# EAGLE design Electro Transmitter Rev 1 (EAGLE 9.5.0)
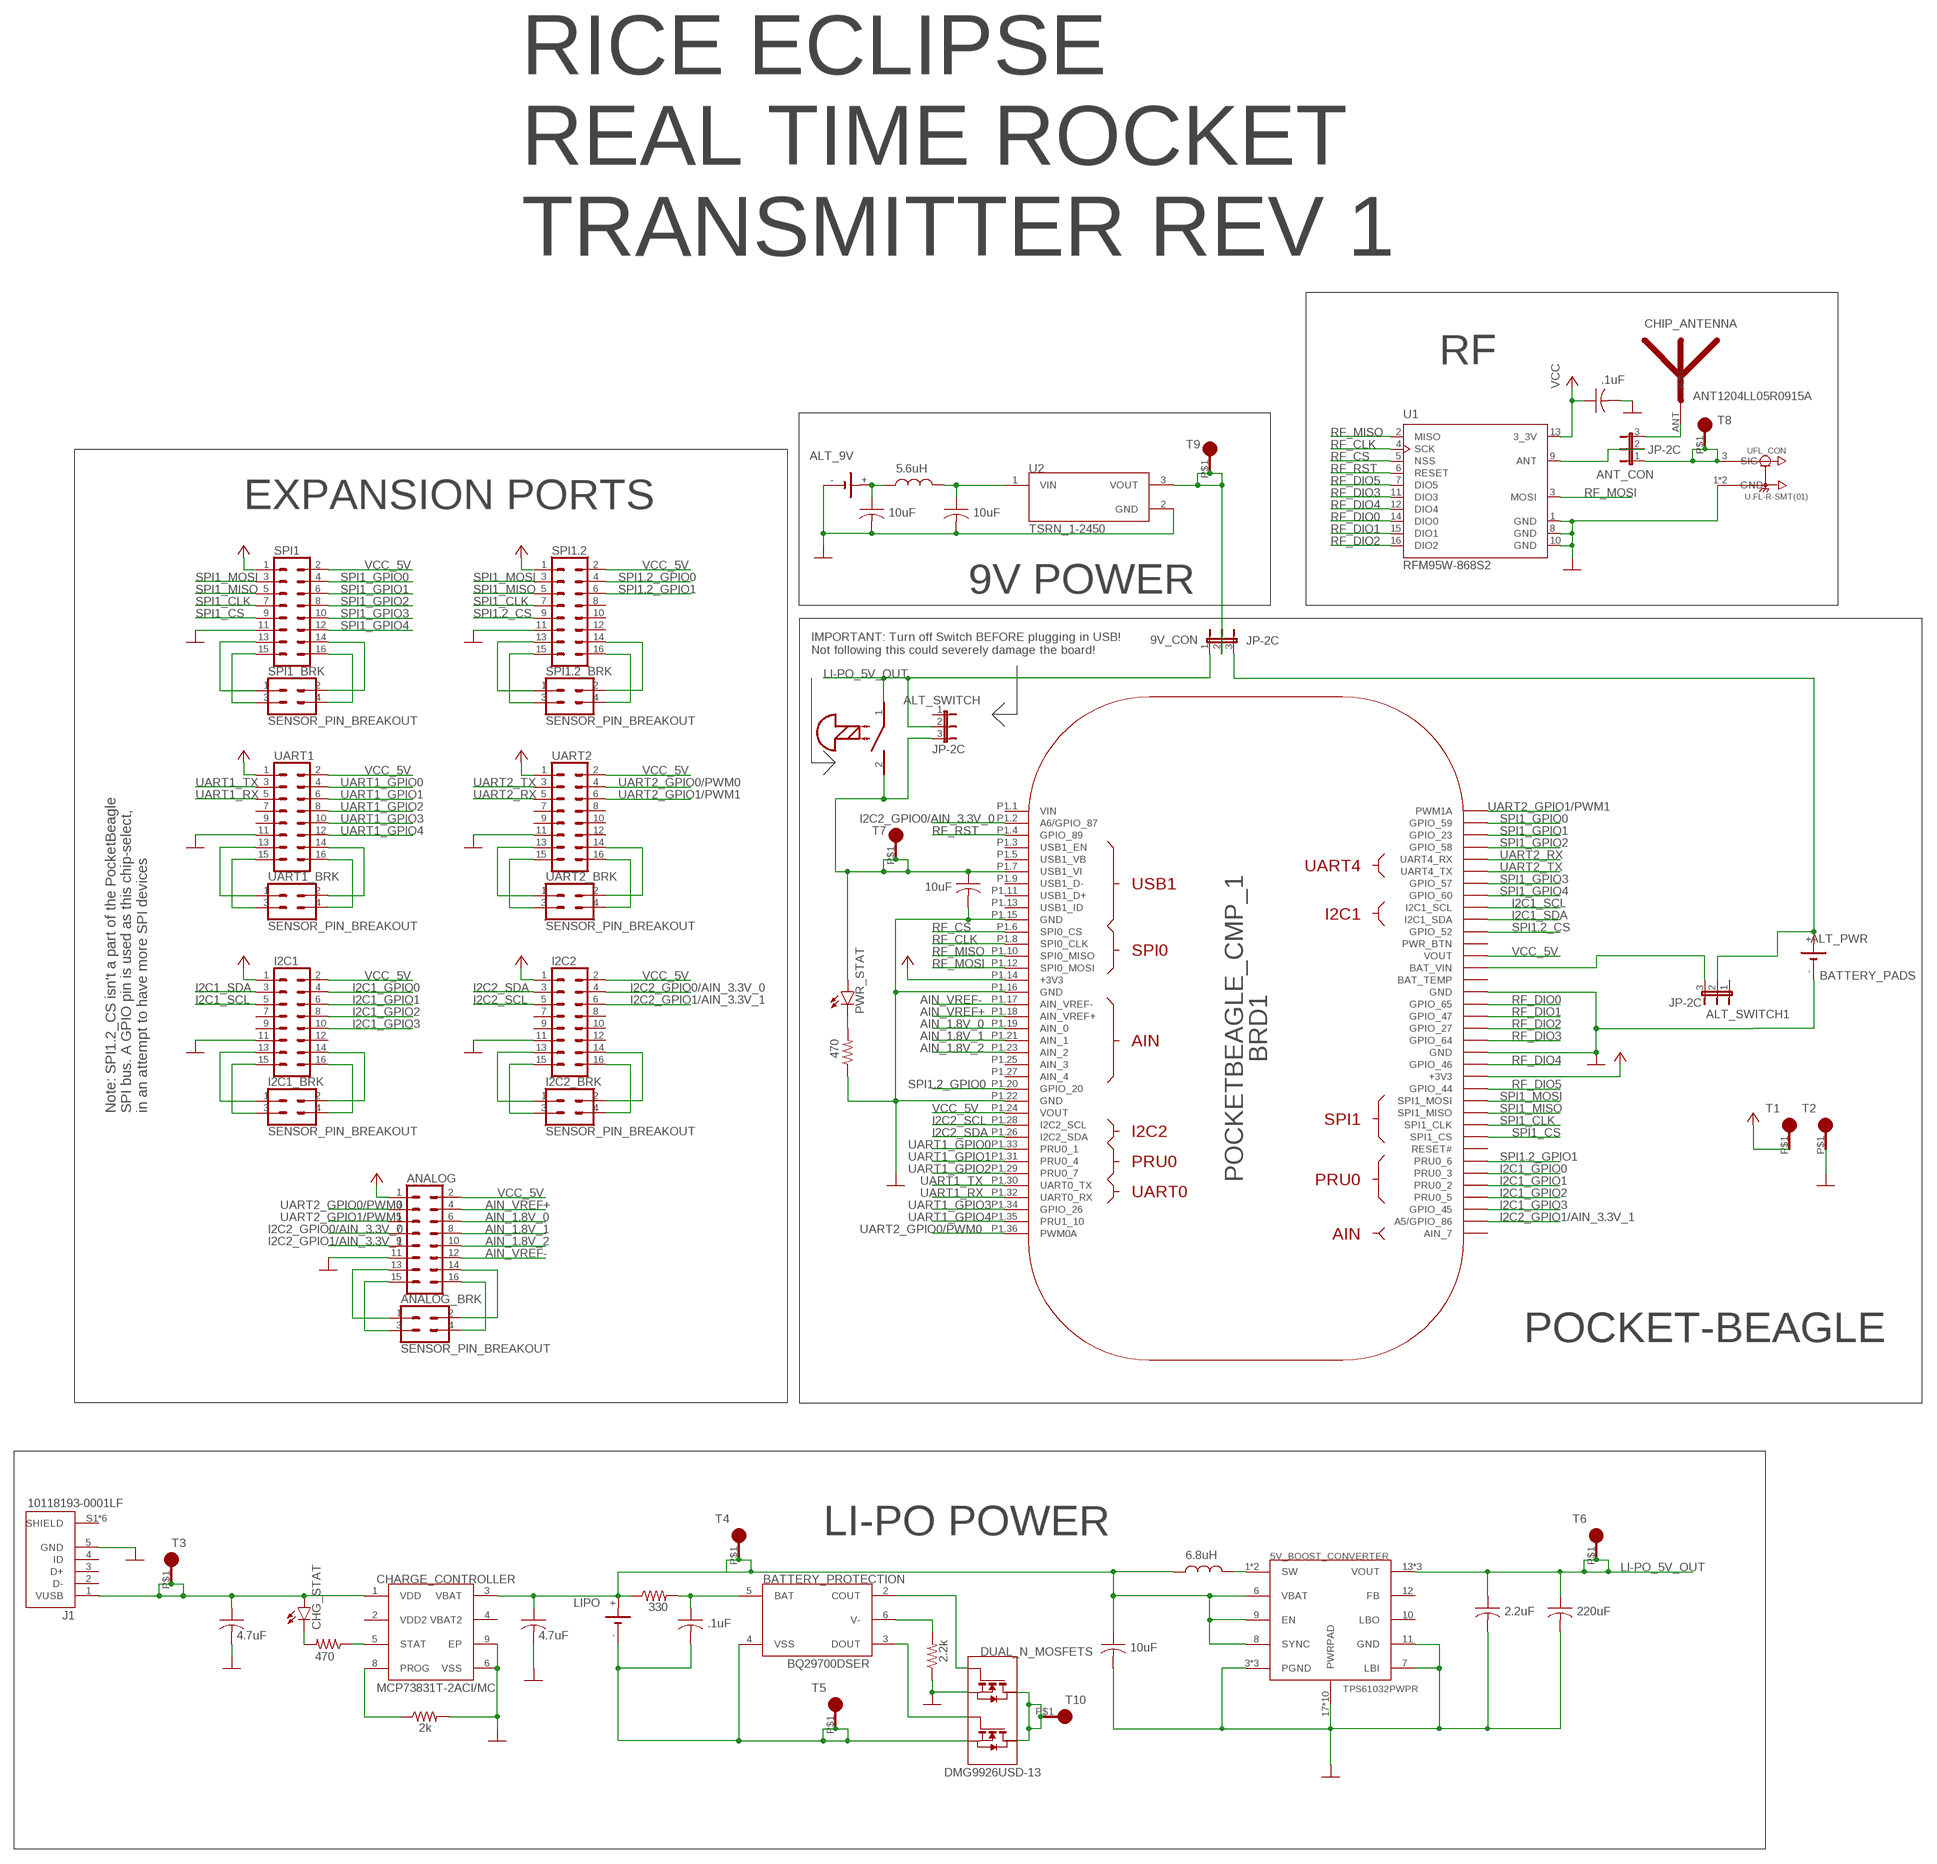
[diagram p0: schematic, sheet 1]

## Parts
5V_BOOST_CONVERTER  TPS61032PWPR  [SOP65P640X110-17N]
9V_C1  10uF  C-SMD  [C1206]
9V_C2  10uF  C-SMD  [C1206]
9V_CON  JP-2C  [JP2]
9V_L1  5.6uH  L_SMD  [L-DS75LC]
ALT_9V  BATTERY_PADS  [POWER_PADS]
ALT_PWR  BATTERY_PADS  [POWER_PADS]
ALT_SWITCH  JP-2C  [JP2]
ALT_SWITCH1  JP-2C  [JP2]
ANALOG  2X6 FEMALE  SENSOR_BREAKOUTPTH_FEMALE  [2X7]
ANALOG_BRK  SENSOR_PIN_BREAKOUT  [2X2]
ANT_CON  JP-2C  [JP2]
BAT_C1  .1uF  C-SMD  [C1206]
BAT_PWR  SCREW_SWITCH  [SCREW_SWITCH]
BAT_R1  330  R-SMD1206  [R1206]
BAT_R2  2.2k  R-SMD1206  [R1206]
BATTERY_PROTECTION  BQ29700DSER  [SON50P150X150X80-6N]
BRD1  POCKETBEAGLE_CMP_1  [POCKETBEAGLE_CMP]
CHARGE_CONTROLLER  MCP73831T-2ACI/MC  [SON50P200X300X100-9N]
CHG_C1  4.7uF  C-SMD  [C1206]
CHG_C2  4.7uF  C-SMD  [C1206]
CHG_R1  470  R-SMD1206  [R1206]
CHG_R2  2k  R-SMD1206  [R1206]
CHG_STAT  LED5MM  [LED5MM]
CHIP_ANTENNA  ANT1204LL05R0915A  [SMD_ANTENNA]
CONV_C1  10uF  C-SMD  [C1206]
CONV_C2  2.2uF  C-SMD  [C1206]
CONV_C3  220uF  C-SMD  [C1206]
CONV_L1  6.8uH  L_SMD  [L-DS75LC]
DUAL_N_MOSFETS  DMG9926USD-13  [SOIC127P600X175-8N]
I2C1  2X6 FEMALE  SENSOR_BREAKOUTPTH_FEMALE  [2X7]
I2C1_BRK  SENSOR_PIN_BREAKOUT  [2X2]
I2C2  2X6 FEMALE  SENSOR_BREAKOUTPTH_FEMALE  [2X7]
I2C2_BRK  SENSOR_PIN_BREAKOUT  [2X2]
J1  10118193-0001LF  [FCI_10118193-0001LF]
LED_R_1  470  R-SMD1206  [R1206]
LIPO  BATTERY_PADS  [POWER_PADS]
PWR_C1  10uF  C-SMD  [C1206]
PWR_STAT  LED5MM  [LED5MM]
RF_C1  .1uF  C-SMD  [C1206]
SPI1  2X6 FEMALE  SENSOR_BREAKOUTPTH_FEMALE  [2X7]
SPI1.2  2X6 FEMALE  SENSOR_BREAKOUTPTH_FEMALE  [2X7]
SPI1.2_BRK  SENSOR_PIN_BREAKOUT  [2X2]
SPI1_BRK  SENSOR_PIN_BREAKOUT  [2X2]
T1  TEST_PAD  [TEST_PAD]
T2  TEST_PAD  [TEST_PAD]
T3  TEST_PAD  [TEST_PAD]
T4  TEST_PAD  [TEST_PAD]
T5  TEST_PAD  [TEST_PAD]
T6  TEST_PAD  [TEST_PAD]
T7  TEST_PAD  [TEST_PAD]
T8  TEST_PAD  [TEST_PAD]
T9  TEST_PAD  [TEST_PAD]
T10  TEST_PAD  [TEST_PAD]
U1  RFM95W-868S2  [XCVR_RFM95W-868S2]
U2  TSRN_1-2450  [CONV_TSRN_1-2433]
UART1  2X6 FEMALE  SENSOR_BREAKOUTPTH_FEMALE  [2X7]
UART1_BRK  SENSOR_PIN_BREAKOUT  [2X2]
UART2  2X6 FEMALE  SENSOR_BREAKOUTPTH_FEMALE  [2X7]
UART2_BRK  SENSOR_PIN_BREAKOUT  [2X2]
UFL_CON  U.FL-R-SMT(01)  [HRS_U.FL-R-SMT(01)]

## Nets
9V_+: 9V_C1.1 9V_L1.P$1 ALT_9V.+
9V_VIN: 9V_C2.1 9V_L1.P$2 U2.1(VIN)
9V_VOUT: 9V_CON.2 T9.P$1 U2.3(VOUT)
AIN_1.8V_0: ANALOG.6 BRD1.P1.19(AIN_0)
AIN_1.8V_1: ANALOG.8 BRD1.P1.21(AIN_1)
AIN_1.8V_2: ANALOG.10 BRD1.P1.23(AIN_2)
AIN_VREF+: ANALOG.4 BRD1.P1.18(AIN_VREF+)
AIN_VREF-: ANALOG.12 BRD1.P1.17(AIN_VREF-)
ALT_PWR_+: 9V_CON.3 ALT_PWR.+ ALT_SWITCH1.2
ANT: ANT_CON.3 CHIP_ANTENNA.ANT
BAT: BAT_C1.1 BAT_R1.2 BATTERY_PROTECTION.5(BAT)
BAT_VIN: ALT_SWITCH1.3 BRD1.P2.14(BAT_VIN)
COUT: BATTERY_PROTECTION.2(COUT) DUAL_N_MOSFETS.2(G1)
DOUT: BATTERY_PROTECTION.3(DOUT) DUAL_N_MOSFETS.4(G2)
DRAIN: DUAL_N_MOSFETS.5(D2) DUAL_N_MOSFETS.6(D2) DUAL_N_MOSFETS.7(D1) DUAL_N_MOSFETS.8(D1) T10.P$1
GND: 5V_BOOST_CONVERTER.3(PGND) 5V_BOOST_CONVERTER.4(PGND) 5V_BOOST_CONVERTER.5(PGND) 5V_BOOST_CONVERTER.7(LBI) 5V_BOOST_CONVERTER.11(GND) 5V_BOOST_CONVERTER.17(PWRPAD) 5V_BOOST_CONVERTER.P$1(PWRPAD) 5V_BOOST_CONVERTER.P$2(PWRPAD) 5V_BOOST_CONVERTER.P$3(PWRPAD) 5V_BOOST_CONVERTER.P$4(PWRPAD) 5V_BOOST_CONVERTER.P$5(PWRPAD) 5V_BOOST_CONVERTER.P$6(PWRPAD) 5V_BOOST_CONVERTER.P$7(PWRPAD) 5V_BOOST_CONVERTER.P$8(PWRPAD) 5V_BOOST_CONVERTER.P$9(PWRPAD) 9V_C1.2 9V_C2.2 ALT_9V.- ALT_PWR.- ANALOG.11 BAT_R2.1 BRD1.P1.15(GND) BRD1.P1.16(GND) BRD1.P1.22(GND) BRD1.P2.15(GND) BRD1.P2.21(GND) CHARGE_CONTROLLER.6(VSS) CHARGE_CONTROLLER.9(EP) CHG_C1.2 CHG_C2.2 CHG_R2.2 CONV_C1.2 CONV_C2.2 CONV_C3.2 DUAL_N_MOSFETS.1(S1) I2C1.11 I2C2.11 J1.5(GND) LED_R_1.1 PWR_C1.2 RF_C1.2 SPI1.2.11 SPI1.11 T2.P$1 U1.1(GND) U1.8(GND) U1.10(GND) U2.2(GND) UART1.11 UART2.11 UFL_CON.1(GND) UFL_CON.2(GND)
I2C1_GPIO0: BRD1.P2.30(PRU0_3) I2C1.4
I2C1_GPIO1: BRD1.P2.32(PRU0_2) I2C1.6
I2C1_GPIO2: BRD1.P2.34(PRU0_5) I2C1.8
I2C1_GPIO3: BRD1.P2.33(GPIO_45) I2C1.10
I2C1_SCL: BRD1.P2.9(I2C1_SCL) I2C1.5
I2C1_SDA: BRD1.P2.11(I2C1_SDA) I2C1.3
I2C2_GPIO0/AIN_3.3V_0: ANALOG.7 BRD1.P1.2(A6/GPIO_87) I2C2.4
I2C2_GPIO1/AIN_3.3V_1: ANALOG.9 BRD1.P2.35(A5/GPIO_86) I2C2.6
I2C2_SCL: BRD1.P1.28(I2C2_SCL) I2C2.5
I2C2_SDA: BRD1.P1.26(I2C2_SDA) I2C2.3
LED: LED_R_1.2 PWR_STAT.K(C)
LED-: CHG_R1.2 CHG_STAT.K(C)
LI-PO_5V_OUT: 5V_BOOST_CONVERTER.13(VOUT) 5V_BOOST_CONVERTER.14(VOUT) 5V_BOOST_CONVERTER.15(VOUT) 9V_CON.1 ALT_SWITCH.2 BAT_PWR.1 CONV_C2.1 CONV_C3.1 T6.P$1
LI-PO_+: 5V_BOOST_CONVERTER.6(VBAT) 5V_BOOST_CONVERTER.8(SYNC) 5V_BOOST_CONVERTER.9(EN) BAT_R1.1 CHARGE_CONTROLLER.3(VBAT) CHG_C2.1 CONV_C1.1 CONV_L1.P$1 LIPO.+ T4.P$1
LI-PO_-: BAT_C1.2 BATTERY_PROTECTION.4(VSS) DUAL_N_MOSFETS.3(S2) LIPO.- T5.P$1
N$1: ANT_CON.1 T8.P$1 UFL_CON.3(SIG)
N$20: 5V_BOOST_CONVERTER.1(SW) 5V_BOOST_CONVERTER.2(SW) CONV_L1.P$2
N$21: SPI1.14 SPI1_BRK.2
N$23: SPI1.13 SPI1_BRK.1
N$24: SPI1.15 SPI1_BRK.3
N$25: SPI1.16 SPI1_BRK.4
N$26: SPI1.2.13 SPI1.2_BRK.1
N$27: SPI1.2.14 SPI1.2_BRK.2
N$28: SPI1.2.16 SPI1.2_BRK.4
N$29: SPI1.2.15 SPI1.2_BRK.3
N$30: UART1.13 UART1_BRK.1
N$31: UART1.15 UART1_BRK.3
N$32: UART1.14 UART1_BRK.2
N$33: UART1.16 UART1_BRK.4
N$35: UART2.15 UART2_BRK.3
N$36: UART2.16 UART2_BRK.4
N$37: UART2.14 UART2_BRK.2
N$38: UART2.13 UART2_BRK.1
N$39: I2C1.16 I2C1_BRK.4
N$40: I2C1.15 I2C1_BRK.3
N$41: I2C1.13 I2C1_BRK.1
N$42: I2C1.14 I2C1_BRK.2
N$43: I2C2.15 I2C2_BRK.3
N$44: I2C2.16 I2C2_BRK.4
N$45: I2C2.14 I2C2_BRK.2
N$46: I2C2.13 I2C2_BRK.1
N$47: ANALOG.15 ANALOG_BRK.3
N$48: ANALOG.16 ANALOG_BRK.4
N$49: ANALOG.14 ANALOG_BRK.2
N$50: ANALOG.13 ANALOG_BRK.1
PROG: CHARGE_CONTROLLER.8(PROG) CHG_R2.1
RF_ANT: ANT_CON.2 U1.9(ANT)
RF_CLK: BRD1.P1.8(SPI0_CLK) U1.4(SCK)
RF_CS: BRD1.P1.6(SPI0_CS) U1.5(NSS)
RF_DIO0: BRD1.P2.17(GPIO_65) U1.14(DIO0)
RF_DIO1: BRD1.P2.18(GPIO_47) U1.15(DIO1)
RF_DIO2: BRD1.P2.19(GPIO_27) U1.16(DIO2)
RF_DIO3: BRD1.P2.20(GPIO_64) U1.11(DIO3)
RF_DIO4: BRD1.P2.22(GPIO_46) U1.12(DIO4)
RF_DIO5: BRD1.P2.24(GPIO_44) U1.7(DIO5)
RF_MISO: BRD1.P1.10(SPI0_MISO) U1.2(MISO)
RF_MOSI: BRD1.P1.12(SPI0_MOSI) U1.3(MOSI)
RF_RST: BRD1.P1.4(GPIO_89) U1.6(RESET)
SPI1.2_CS: BRD1.P2.10(GPIO_52) SPI1.2.9
SPI1.2_GPIO0: BRD1.P1.20(GPIO_20) SPI1.2.4
SPI1.2_GPIO1: BRD1.P2.28(PRU0_6) SPI1.2.6
SPI1_CLK: BRD1.P2.29(SPI1_CLK) SPI1.2.7 SPI1.7
SPI1_CS: BRD1.P2.31(SPI1_CS) SPI1.9
SPI1_GPIO0: BRD1.P2.2(GPIO_59) SPI1.4
SPI1_GPIO1: BRD1.P2.3(GPIO_23) SPI1.6
SPI1_GPIO2: BRD1.P2.4(GPIO_58) SPI1.8
SPI1_GPIO3: BRD1.P2.6(GPIO_57) SPI1.10
SPI1_GPIO4: BRD1.P2.8(GPIO_60) SPI1.12
SPI1_MISO: BRD1.P2.27(SPI1_MISO) SPI1.2.5 SPI1.5
SPI1_MOSI: BRD1.P2.25(SPI1_MOSI) SPI1.2.3 SPI1.3
STAT: CHARGE_CONTROLLER.5(STAT) CHG_R1.1
SWITCH_5V: ALT_SWITCH.3 BAT_PWR.2 BRD1.P1.7(USB1_VI) PWR_C1.1 PWR_STAT.A T7.P$1
UART1_GPIO0: BRD1.P1.33(PRU0_1) UART1.4
UART1_GPIO1: BRD1.P1.31(PRU0_4) UART1.6
UART1_GPIO2: BRD1.P1.29(PRU0_7) UART1.8
UART1_GPIO3: BRD1.P1.34(GPIO_26) UART1.10
UART1_GPIO4: BRD1.P1.35(PRU1_10) UART1.12
UART1_RX: BRD1.P1.32(UART0_RX) UART1.5
UART1_TX: BRD1.P1.30(UART0_TX) UART1.3
UART2_GPIO0/PWM0: ANALOG.3 BRD1.P1.36(PWM0A) UART2.4
UART2_GPIO1/PWM1: ANALOG.5 BRD1.P2.1(PWM1A) UART2.6
UART2_RX: BRD1.P2.5(UART4_RX) UART2.5
UART2_TX: BRD1.P2.7(UART4_TX) UART2.3
V-: BAT_R2.2 BATTERY_PROTECTION.6(V-)
V_USB: CHARGE_CONTROLLER.1(VDD) CHG_C1.1 CHG_STAT.A J1.1(VUSB) T3.P$1
VCC: ANALOG.1 BRD1.P1.14(+3V3) BRD1.P2.23(+3V3) I2C1.1 I2C2.1 RF_C1.1 SPI1.1 SPI1.2.1 T1.P$1 U1.13(3_3V) UART1.1 UART2.1
VCC_5V: ANALOG.2 BRD1.P1.24(VOUT) BRD1.P2.13(VOUT) I2C1.2 I2C2.2 SPI1.2 SPI1.2.2 UART1.2 UART2.2
Unconnected: 5V_BOOST_CONVERTER.10(LBO) 5V_BOOST_CONVERTER.12(FB) ALT_SWITCH1.1 ALT_SWITCH.1 BRD1.P1.1(VIN) BRD1.P1.3(USB1_EN) BRD1.P1.5(USB1_VB) BRD1.P1.9(USB1_D-) BRD1.P1.11(USB1_D+) BRD1.P1.13(USB1_ID) BRD1.P1.25(AIN_3) BRD1.P1.27(AIN_4) BRD1.P2.12(PWR_BTN) BRD1.P2.16(BAT_TEMP) BRD1.P2.26(RESET#) BRD1.P2.36(AIN_7) I2C1.7 I2C1.9 I2C1.12 I2C2.7 I2C2.8 I2C2.9 I2C2.10 I2C2.12 J1.2(D-) J1.3(D+) J1.4(ID) J1.S1(SHIELD) J1.S2(SHIELD) J1.S3(SHIELD) J1.S4(SHIELD) J1.S5(SHIELD) J1.S6(SHIELD) SPI1.2.8 SPI1.2.10 SPI1.2.12 UART1.7 UART1.9 UART2.7 UART2.8 UART2.9 UART2.10 UART2.12

## Notes on the sheet
- RICE ECLIPSE
  REAL TIME ROCKET
  TRANSMITTER REV 1
- RF
- EXPANSION PORTS
- 9V POWER
- IMPORTANT: Turn off Switch BEFORE plugging in USB! 
  Not following this could severely damage the board!
- Note: SPI1.2_CS isn't a part of the PocketBeagle 
  SPI bus. A GPIO pin is used as this chip-select, 
  in an attempt to have more SPI devices
- POCKET-BEAGLE
- LI-PO POWER

## Power pins joined to a net without a drawn wire
VBAT2: CHARGE_CONTROLLER.4(VBAT2)
VDD2: CHARGE_CONTROLLER.2(VDD2)

## Library data of the parts
5V_BOOST_CONVERTER = RTR:TPS61032PWPR: 5V Buck-Boost Converter; 5V_BOOST_CONVERTER: TPS61032PWPR; F: TPS61032PWPR
9V_C1 9V_C2 BAT_C1 CHG_C1 CHG_C2 CONV_C1-CONV_C3 PWR_C1 RF_C1 = RTR:C-SMD: SMD capacitor
9V_CON ALT_SWITCH ALT_SWITCH1 ANT_CON = RTR:JP-2C: JUMPER 2 connection jumper
9V_L1 CONV_L1 = RTR:L_SMD: SMD Inductor
ALT_9V ALT_PWR LIPO = RTR:BATTERY_PADS: Pads to connect any battery (Li-Po, 9V, etc.)
ANALOG I2C1 I2C2 SPI1.2 UART1 UART2 = RTR:SENSOR_BREAKOUT: .1 inch-spaced 12P sensor breakout Used as a generalized connector for attaching new sensors; PROD_ID: CONN-12423
ANALOG_BRK I2C1_BRK I2C2_BRK SPI1.2_BRK SPI1_BRK UART1_BRK UART2_BRK = RTR:SENSOR_PIN_BREAKOUT: 4 pin breakout for connecting any extra wires to a sensor without modifying PCB
BAT_PWR = RTR:SCREW_SWITCH: Custom screw switch for integrated PCB design
BAT_R1 BAT_R2 CHG_R1 CHG_R2 LED_R_1 = RTR:R-SMD: SMD resistor
BATTERY_PROTECTION = RTR:BQ29700DSER: Battery Protection IC
BRD1 = RTR:POCKETBEAGLE_?_1: BeagleBoard.org PocketBeagle What is PocketBeagle? PocketBeagle is an ultra-tiny-yet-complete open-source USB-key-fob computer. PocketBeagle features an incredible low cost, slick design and simple usage, making PocketBeagle the ideal development board for beginners and professionals alike. Processor: Octavo Systems OSD3358 1GHz ARMÂ® Cortex-A8 512MB DDR3 RAM integrated Integrated power management 2Ã—32-bit 200-MHz programmable real-time units (PRUs) ARM Cortex-M3 Summary of Key Features Low cost Linux computer with tremendous expansibility Opportunity to learn many programming aspects from educators on-line Openness and flexibility tear-down limits on your imagination Summary of Technical Specifications Based on new Octavo Systems OSD3358-SM 21mm x 21mm system-in-package that includes 512MB DDR3 RAM, 1-GHz ARM Cortex-A8 CPU, 2x 200-MHz PRUs, ARM Cortex-M3, 3D accelerator, power/battery management and EEPROM 72 expansion pin headers with power and battery I/Os, high-speed USB, 8 analog inputs, 44 digital I/Os and numerous digital interface peripherals microUSB host/client and microSD connectors
CHARGE_CONTROLLER = RTR:MCP73831T-2ACI/MC: MCP73831T-2ACI/MC Charge Controller
CHG_STAT PWR_STAT = RTR:LED: LED OSRAM: - CHIPLED LG R971, LG N971, LY N971, LG Q971, LY Q971, LO R971, LY R971 LH N974, LH R974 LS Q976, LO Q976, LY Q976 LO Q996 - Hyper CHIPLED LW Q18S LB Q993, LB Q99A, LB R99A - SideLED LS A670, LO A670, LY A670, LG A670, LP A670 LB A673, LV A673, LT A673, LW A673 LH A674 LY A675 LS A676, LA A676, LO A676, LY A676, LW A676 LS A679, LY A679, LG A679 - Hyper Micro SIDELED® LS Y876, LA Y876, LO Y876, LY Y876 LT Y87S - SmartLED LW L88C, LW L88S LB L89C, LB L89S, LG L890 LS L89K, LO L89K, LY L89K LS L896, LA L896, LO L896, LY L896 - TOPLED LS T670, LO T670, LY T670, LG T670, LP T670 LSG T670, LSP T670, LSY T670, LOP T670, LYG T670 LG T671, LOG T671, LSG T671 LB T673, LV T673, LT T673, LW T673 LH T674 LS T676, LA T676, LO T676, LY T676, LB T676, LH T676, LSB T676, LW T676 LB T67C, LV T67C, LT T67C, LS T67K, LO T67K, LY T67K, LW E67C LS E67B, LA E67B, LO E67B, LY E67B, LB E67C, LV E67C, LT E67C LW T67C LS T679, LY T679, LG T679 LS T770, LO T770, LY T770, LG T770, LP T770 LB T773, LV T773, LT T773, LW T773 LH T774 LS E675, LA E675, LY E675, LS T675 LS T776, LA T776, LO T776, LY T776, LB T776 LHGB T686 LT T68C, LB T68C - Hyper Mini TOPLED® LB M676 - Mini TOPLED Santana® LG M470 LS M47K, LO M47K, LY M47K Source: http://www.osram.convergy.de LUXEON: - LUMILED® LXK2-PW12-R00, LXK2-PW12-S00, LXK2-PW14-U00, LXK2-PW14-V00 LXK2-PM12-R00, LXK2-PM12-S00, LXK2-PM14-U00 LXK2-PE12-Q00, LXK2-PE12-R00, LXK2-PE12-S00, LXK2-PE14-T00, LXK2-PE14-U00 LXK2-PB12-K00, LXK2-PB12-L00, LXK2-PB12-M00, LXK2-PB14-N00, LXK2-PB14-P00, LXK2-PB14-Q00 LXK2-PR12-L00, LXK2-PR12-M00, LXK2-PR14-Q00, LXK2-PR14-R00 LXK2-PD12-Q00, LXK2-PD12-R00, LXK2-PD12-S00 LXK2-PH12-R00, LXK2-PH12-S00 LXK2-PL12-P00, LXK2-PL12-Q00, LXK2-PL12-R00 Source: www.luxeon.com KINGBRIGHT: KA-3528ASYC Source: www.kingbright.com
CHIP_ANTENNA = RTR:ANT1204LL05R0915A: On board chip antenna
DUAL_N_MOSFETS = RTR:DMG9926USD-13: Dual N-Channel MOSFET
J1 = RTR:10118193-0001LF: Micro USB B Type Receptacle; AVAILABILITY: Unavailable; DESCRIPTION: Single Port 5 Contact Shielded SMT MICRO USB B-Type Receptacle; MF: Amphenol ICC; MP: 10118193-0001LF; PACKAGE: None; PRICE: None
SPI1 = RTR Main Library:SENSOR_BREAKOUT: .1 inch-spaced 12P sensor breakout Used as a generalized connector for attaching new sensors; PROD_ID: CONN-12423
T1-T10 = RTR:TEST_PAD: Test pad
U1 = RTR:RFM95W-868S2: RFM95 Transceiver; AVAILABILITY: Unavailable; MF: RF; MP: RFM95W-868S2; PACKAGE: SMD-16 Hope Microelectronics; PRICE: None
U2 = RTR:TSRN_1-2450: 1.6 A Watt, 6.5-42VDCVin, Quad Output, 5V@1A | -5V@0.6A Switching Regulators DC-DC Converter; AVAILABILITY: Unavailable; DESCRIPTION: 1.6 A Watt, 6.5-42VDCVin, Quad Output, 5V@1A | -5V@0.6A Switching Regulators DC-DC Converter; MF: Traco Power; MP: TSRN 1-2450; PACKAGE: SIP-3 Tracopower; PRICE: None
UFL_CON = RTR:U.FL-R-SMT(01): U.FL Series 6 Ghz 50 Ohm Ultra-small SMT Coaxial Cable Receptacle; DESCRIPTION: U.FL Series 6 Ghz 50 Ohm Ultra-small SMT Coaxial Cable Receptacle; DIGI-KEY_PART_NUMBER: H9161-ND; DIGI-KEY_PURCHASE_URL: https://www.digikey.com/product-detail/en/hirose-electric-co-ltd/U.FL-R-SMT_01_/H9161-ND/513010?utm_source=snapeda&utm_medium=aggregator&utm_campaign=symbol; MF: Hirose; MP: U.FL-R-SMT_01_; PACKAGE: None

## Board
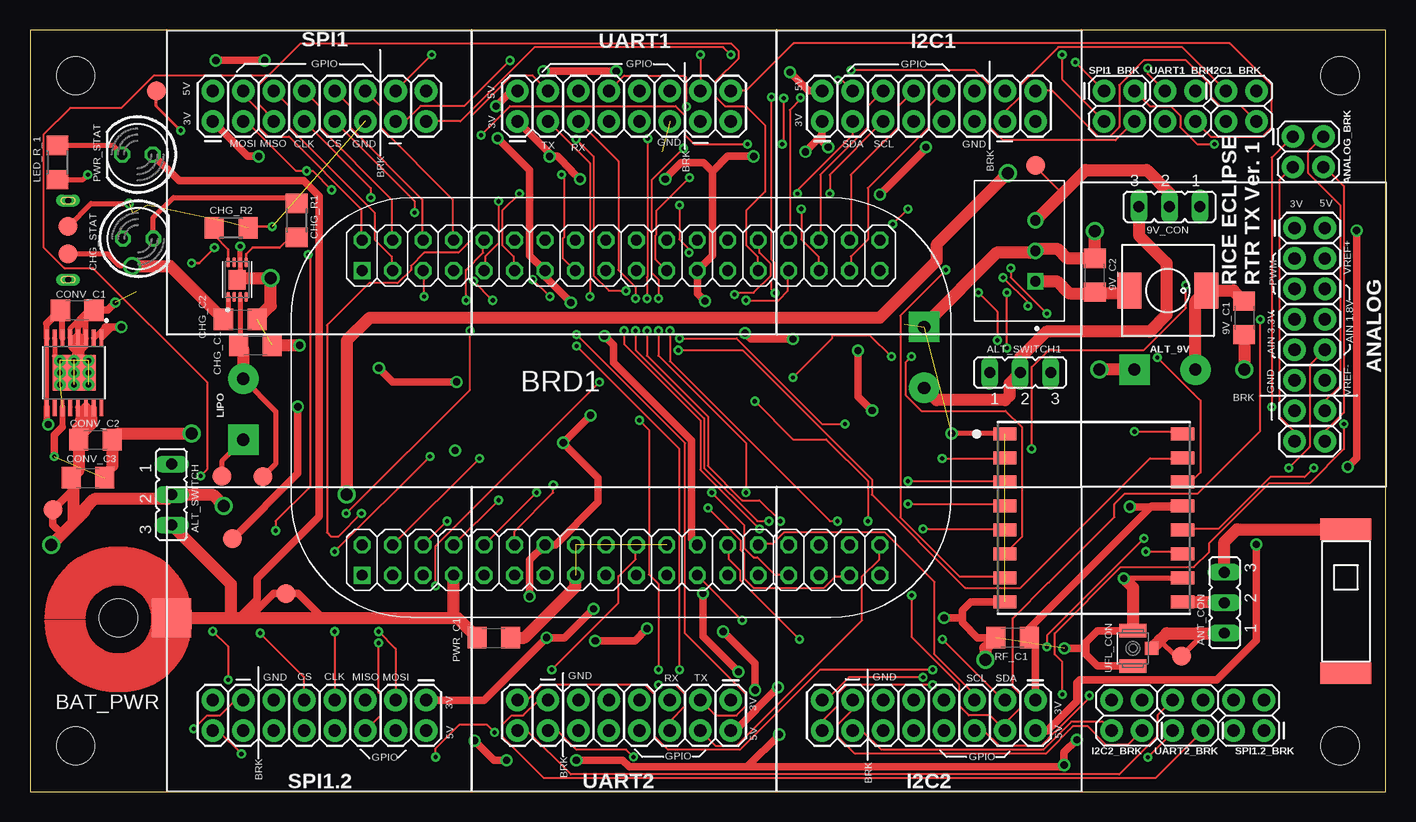
[diagram p1: board, top side]
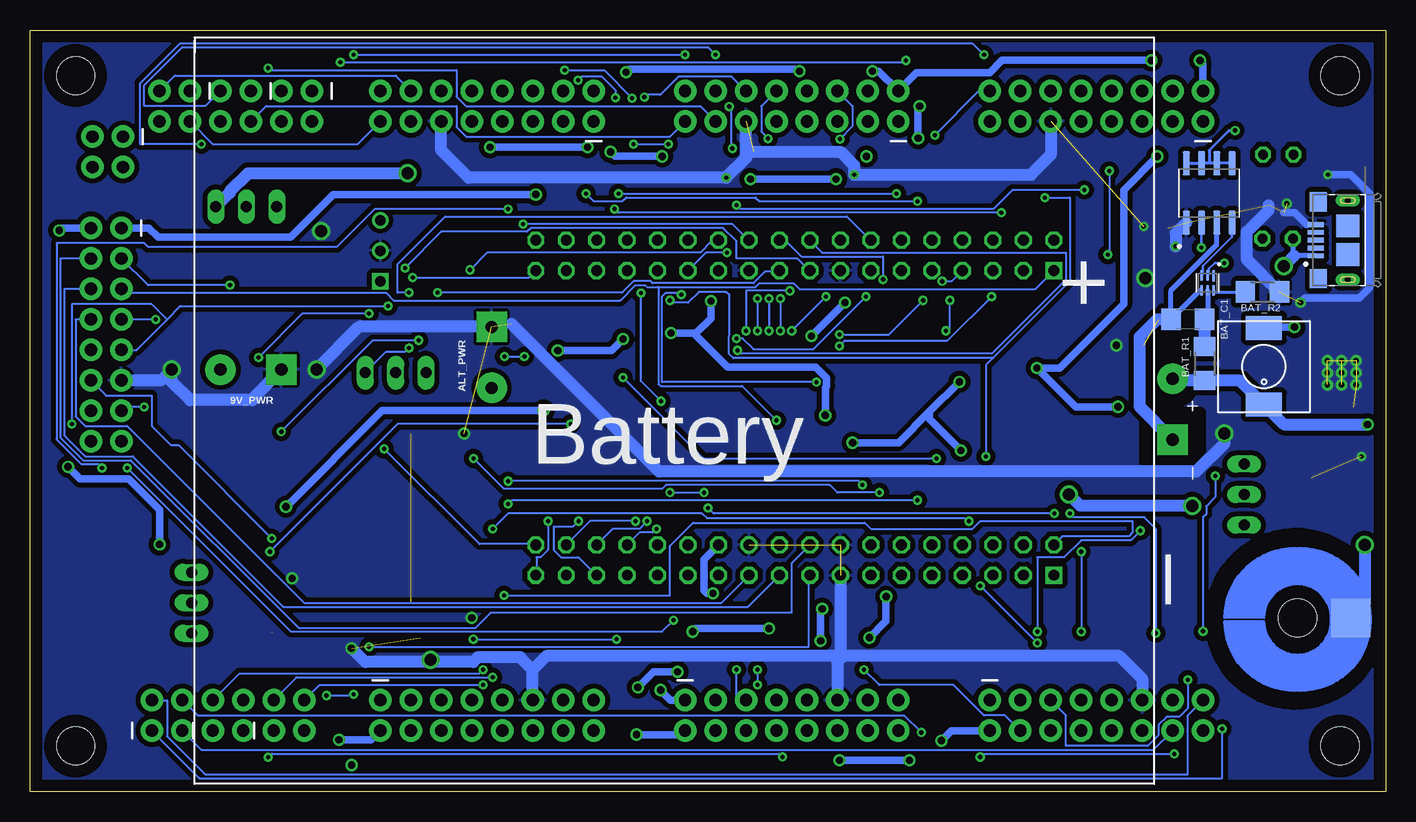
[diagram p2: board, bottom side, seen from below]

Size 113.03 x 63.5 mm. Coordinates in mm from the lower left corner, seen from the top.
Outline: 0,0 113.03,0 113.03,63.5 0,63.5 0,0
Copper layers (1*16): Top 0.035mm / dielectric 1.5mm / Bottom 0.035mm
Design rules "default *": minimum track width 6mil, minimum drill 0.35mm, track to track 6mil, track to pad 6mil, pad to pad 6mil, via to via 6mil, smd to smd 6mil, copper to edge 40mil, drill to drill 6mil, minimum pad ring 10mil, minimum via ring 8mil, stop-mask expansion 4mil, vias tented up to drill 0mil, thermal gap 10mil
Holes 3.17 mm at 3.81,3.81 3.81,59.69 109.22,59.69 109.22,3.81
bRestrict: 19 lines

### Footprints (pad centres in the part's own frame; a part is rotated, then mirrored left to right if it is on the bottom)
SOP65P640X110-17N = smd 1.48 x 0.41: 1 -2.865,2.275; 2 -2.865,1.625; 3 -2.865,0.975; 4 -2.865,0.325; 5 -2.865,-0.325; 6 -2.865,-0.975; 7 -2.865,-1.625; 8 -2.865,-2.275; 9 2.865,-2.275; 10 2.865,-1.625; 11 2.865,-0.975; 12 2.865,-0.325; 13 2.865,0.325; 14 2.865,0.975; 15 2.865,1.625; 16 2.865,2.275 | smd 2.94 x 3.58: 17 0,0 | drill 0.45 pad 0.559: P$1 -1,1.2; P$2 0,1.2; P$3 1,1.2; P$4 -1,0; P$5 0,0; P$6 1,0; P$7 -1,-1.2; P$8 0,-1.2; P$9 1,-1.2
C1206 = smd 1.6 x 1.8: 1 -1.4,0; 2 1.4,0
JP2 = drill 0.914 long: 1 -2.54,0; 2 0,0; 3 2.54,0
L-DS75LC = smd 2 x 3: P$1 -3.175,0; P$2 3.225,0
POWER_PADS = drill 1.016 pad 2.54: + 2.54,0 | drill 1.016 pad 2.54 square: - -2.54,0
2X7 = drill 1.016 pad 1.88: 1 -8.89,5.08; 2 -8.89,7.62; 3 -6.35,5.08; 4 -6.35,7.62; 5 -3.81,5.08; 6 -3.81,7.62; 7 -1.27,5.08; 8 -1.27,7.62; 9 1.27,5.08; 10 1.27,7.62; 11 3.81,5.08; 12 3.81,7.62; 13 6.35,5.08; 14 6.35,7.62; 15 8.89,5.08; 16 8.89,7.62
2X2 = drill 1.016 pad 1.88: 1 -1.27,-1.27; 2 -1.27,1.27; 3 1.27,-1.27; 4 1.27,1.27
SCREW_SWITCH = smd 3.251 x 3.251 bottom: 1 4.445,0 | smd 3.251 x 3.251: 2 -4.445,0 | hole 3.175: 0,0
R1206 = smd 1.6 x 1.803: 1 -1.422,0; 2 1.422,0
SON50P150X150X80-6N = smd 1.02 x 0.27: 1 -0.59,0.5 | smd 0.94 x 0.27: 2 -0.63,0; 3 -0.63,-0.5; 4 0.63,-0.5; 5 0.63,0; 6 0.63,0.5
POCKETBEAGLE_CMP = drill 0.9 square: P1.1 -21.59,-13.97; P2.1 -21.59,11.43 | drill 0.9 octagon: P1.2 -21.59,-11.43; P1.3 -19.05,-13.97; P1.4 -19.05,-11.43; P1.5 -16.51,-13.97; P1.6 -16.51,-11.43; P1.7 -13.97,-13.97; P1.8 -13.97,-11.43; P1.9 -11.43,-13.97; P1.10 -11.43,-11.43; P1.11 -8.89,-13.97; P1.12 -8.89,-11.43; P1.13 -6.35,-13.97; P1.14 -6.35,-11.43; P1.15 -3.81,-13.97; P1.16 -3.81,-11.43; P1.17 -1.27,-13.97; P1.18 -1.27,-11.43; P1.19 1.27,-13.97; P1.20 1.27,-11.43; P1.21 3.81,-13.97; P1.22 3.81,-11.43; P1.23 6.35,-13.97; P1.24 6.35,-11.43; P1.25 8.89,-13.97; P1.26 8.89,-11.43; P1.27 11.43,-13.97; P1.28 11.43,-11.43; P1.29 13.97,-13.97; P1.30 13.97,-11.43; P1.31 16.51,-13.97; P1.32 16.51,-11.43; P1.33 19.05,-13.97; P1.34 19.05,-11.43; P1.35 21.59,-13.97; P1.36 21.59,-11.43; P2.2 -21.59,13.97; P2.3 -19.05,11.43; P2.4 -19.05,13.97; P2.5 -16.51,11.43; P2.6 -16.51,13.97; P2.7 -13.97,11.43; P2.8 -13.97,13.97; P2.9 -11.43,11.43; P2.10 -11.43,13.97; P2.11 -8.89,11.43; P2.12 -8.89,13.97; P2.13 -6.35,11.43; P2.14 -6.35,13.97; P2.15 -3.81,11.43; P2.16 -3.81,13.97; P2.17 -1.27,11.43; P2.18 -1.27,13.97; P2.19 1.27,11.43; P2.20 1.27,13.97; P2.21 3.81,11.43; P2.22 3.81,13.97; P2.23 6.35,11.43; P2.24 6.35,13.97; P2.25 8.89,11.43; P2.26 8.89,13.97; P2.27 11.43,11.43; P2.28 11.43,13.97; P2.29 13.97,11.43; P2.30 13.97,13.97; P2.31 16.51,11.43; P2.32 16.51,13.97; P2.33 19.05,11.43; P2.34 19.05,13.97; P2.35 21.59,11.43; P2.36 21.59,13.97
SON50P200X300X100-9N = smd 0.84 x 0.27: 1 -1.435,0.75; 2 -1.435,0.25; 3 -1.435,-0.25; 4 -1.435,-0.75; 5 1.435,-0.75; 6 1.435,-0.25; 7 1.435,0.25; 8 1.435,0.75 | smd 1.625 x 1.425: 9 0,0
LED5MM = drill 0.813 octagon: A -1.27,0; K 1.27,0
SMD_ANTENNA = smd 1.8 x 4.25: ANT -6,0; DUMMY 6,0
SOIC127P600X175-8N = smd 1.97 x 0.59: 1 -2.475,1.905; 2 -2.475,0.635; 3 -2.475,-0.635; 4 -2.475,-1.905; 5 2.475,-1.905; 6 2.475,-0.635; 7 2.475,0.635; 8 2.475,1.905
FCI_10118193-0001LF = smd 0.4 x 1.35: 1 -1.3,2.675; 2 -0.65,2.675; 3 0,2.675; 4 0.65,2.675; 5 1.3,2.675 | smd 1.6 x 1.4: S1 -3.2,2.45; S2 3.2,2.45 | smd 1.9 x 1.9: S3 1.2,0; S4 -1.2,0 | drill 0.5 pad 0.9 long: S5 -3.3,0; S6 3.3,0
TEST_PAD = smd 1.587 x 1.587: P$1 0,0
XCVR_RFM95W-868S2 = smd 1.95 x 1.05: 1 -7.4,7; 2 -7.4,5; 3 -7.4,3; 4 -7.4,1; 5 -7.4,-1; 6 -7.4,-3; 7 -7.4,-5; 8 -7.4,-7; 9 7.4,-7; 10 7.4,-5; 11 7.4,-3; 12 7.4,-1; 13 7.4,1; 14 7.4,3; 15 7.4,5; 16 7.4,7
CONV_TSRN_1-2433 = drill 0.84 square: 1 0,0 | drill 0.84: 2 2.54,0; 3 5.08,0
HRS_U.FL-R-SMT(01) = smd 1.1 x 2.25: 1 -1.475,0; 2 1.475,0 | smd 1.05 x 1.1: 3 0,-1.55

### Placement (x,y rotation side)
5V_BOOST_CONVERTER  3.68,34.92 270 top
9V_C1  101.22,39.5 270 top
9V_C2  88.77,43.05 90 top
9V_CON  95,48.77 180 top
9V_L1  94.87,41.78 180 top
ALT_9V  94.61,35.18 0 top
ALT_PWR  74.55,36.2 270 bottom
ALT_SWITCH  11.81,24.77 270 top
ALT_SWITCH1  82.55,34.92 0 top
ANALOG  100.33,38.1 270 top
ANALOG_BRK  106.55,53.34 270 top
ANT_CON  99.57,15.75 90 top
BAT_C1  16.51,39.37 180 bottom
BAT_PWR  7.37,14.48 180 top
BAT_R1  15.11,35.69 90 bottom
BAT_R2  10.29,41.66 180 bottom
BATTERY_PROTECTION  14.86,42.42 270 bottom
BRD1  49.28,32 0 top
CHARGE_CONTROLLER  17.27,42.67 90 top
CHG_C1  17.53,39.37 0 top
CHG_C2  18.8,37.21 0 top
CHG_R1  22.23,47.62 90 top
CHG_R2  16.76,46.99 0 top
CHG_STAT  9.02,46.1 0 top
CHIP_ANTENNA  109.7,15.88 270 top
CONV_C1  3.94,40.13 0 top
CONV_C2  5.46,29.34 0 top
CONV_C3  4.83,26.16 0 top
CONV_L1  10.16,35.43 90 bottom
DUAL_N_MOSFETS  14.73,49.91 90 bottom
I2C1  74.93,50.8 0 top
I2C1_BRK  100.97,57.15 270 top
I2C2  74.93,12.7 180 top
I2C2_BRK  91.44,6.35 90 top
J1  3.17,45.97 90 bottom
LED_R_1  2.29,52.45 90 top
LIPO  17.78,31.88 90 top
PWR_C1  38.66,12.83 0 top
PWR_STAT  8.97,53.11 180 top
RF_C1  81.92,12.83 180 top
SPI1  24.13,50.8 0 top
SPI1.2  24.13,12.7 180 top
SPI1.2_BRK  101.6,6.35 90 top
SPI1_BRK  90.81,57.15 270 top
T1  16.89,21.08 0 top
T2  3.17,47.12 0 top
T3  3.17,44.83 0 top
T4  19.41,26.24 0 top
T5  16,26.29 0 top
T6  1.91,23.5 90 top
T7  21.34,16.51 0 top
T8  96.01,11.3 0 top
T9  83.82,52.2 0 top
T10  10.54,58.42 0 top
U1  88.67,22.81 0 top
U2  83.82,42.55 90 top
U$1  [5000MAH_LI-PO_BATTERY]  19.3,0.64 180 bottom
UART1  49.53,50.8 0 top
UART1_BRK  95.89,57.15 270 top
UART2  49.53,12.7 180 top
UART2_BRK  96.52,6.35 90 top
UFL_CON  91.95,11.94 90 top

### Tracks (layer width: path | path; a pad name or v marks a point on that pad's centre or on a via)
9V_+
  Top 1.016: ALT_9V.+ 97.16,40.89 9V_L1.P$1 100.33,41.78 9V_C1.1
9V_VIN
  Top 0.254: 86.61,41.53 86.74,41.53 | 88.65,41.53 9V_C2.1 | 9V_L1.P$2 91.39,41.53
  Top 1.016: U2.1 85.6,42.55 86.61,41.53 | 86.74,41.53 88.65,41.53 91.39,41.53
9V_VOUT
  Top 0.152: 86.07,49.87 83.82,52.12 T9.P$1
  Top 1.016: U2.3 86.07,49.87 88.01,51.82 93.09,51.82 95,49.91 9V_CON.2
AIN_1.8V_0
  Bottom 0.152: BRD1.P1.19 53.18,15.4 91.92,15.4 104.46,27.94 108.43,27.94 110.17,29.69 110.17,41.91 ANALOG.6
AIN_1.8V_1
  Bottom 0.152: BRD1.P1.21 55.4,15.72 90.17,15.72 104.93,30.48 108.43,30.48 109.22,31.27 109.22,39.37 ANALOG.8
AIN_1.8V_2  (via drill 0.35)
  Top 0.152: v59.37,14.29 BRD1.P1.23 | v104.93,26.99 106.68,28.73 106.68,35.56 ANALOG.10
  Bottom 0.152: v59.37,14.29 60.33,13.34 91.28,13.34 v104.93,26.99
AIN_VREF+
  Bottom 0.152: BRD1.P1.18 49.53,19.05 49.53,14.92 74.61,14.92 75.88,13.65 90.65,13.65 104.62,27.62 108.58,27.62 110.49,29.53 110.49,44.45 ANALOG.4
AIN_VREF-  (via drill 0.35)
  Top 0.152: v84.77,12.06 84.77,13.02 v92.87,21.11
  Bottom 0.152: v84.77,12.06 48.1,12.06 48.1,17.94 BRD1.P1.17 | v92.87,21.11 100.65,28.89 101.28,28.89 102.87,30.48 102.87,33.02 106.68,33.02 ANALOG.12
ALT_PWR_+
  Top 1.016: 9V_CON.3 92.46,46.35 94.74,44.07 94.74,39.75 93.34,38.35 84.71,38.35 82.55,36.2 ALT_SWITCH1.2 81.66,34.04 81.66,33.02 81.28,32.64 75.56,32.64 ALT_PWR.+
ANT
  Top 1.016: ANT_CON.3 99.57,20.83 100.61,21.88 CHIP_ANTENNA.ANT
BAT
  Bottom 0.406: BATTERY_PROTECTION.5 14.86,39.62 BAT_C1.1
  Bottom 1.016: BAT_R1.2 BAT_C1.1
BAT_VIN  (via drill 0.35)
  Top 0.152: v81.44,36.99 v81.44,41.59
  Bottom 0.152: v81.44,41.59 82.39,41.59 82.39,43.97 78.42,47.94 44.93,47.94 43.02,46.04 BRD1.P2.14 | v81.44,36.99 81.76,36.67 83.34,36.67 ALT_SWITCH1.3
COUT  (via drill 0.35)
  Top 0.203: v15.38,45.35 14.1,44.07 v13.46,44.07
  Bottom 0.203: BATTERY_PROTECTION.2 14.75,43.16 14.75,43.58 14.26,44.07 v13.46,44.07 | DUAL_N_MOSFETS.2 15.37,45.36 v15.38,45.35
DOUT
  Bottom 0.203: BATTERY_PROTECTION.3 15.25,43.16 15.25,43.8 12.83,46.22 DUAL_N_MOSFETS.4
DRAIN  (via drill 0.35)
  Top 0.254: v12.57,55.12 10.54,57.15 T10.P$1
  Bottom 0.254: 14.61,52.39 DUAL_N_MOSFETS.6 DUAL_N_MOSFETS.5 | 14.61,52.39 14.86,52.39 | 14.86,52.39 DUAL_N_MOSFETS.7 DUAL_N_MOSFETS.8 | 14.61,52.39 14.73,52.51 | v12.57,55.12 13.08,55.12 14.73,53.47 14.73,52.51 | 14.73,52.51 14.86,52.39
GND  (via drill 0.35, 0.4, 0.45, 0.6, 1)  (24 unrouted)
  Top 0.152: 83.34,44.93 U2.2 | v54.99,51.18 52.2,48.39 52.2,46.4 52.15,46.36 52.15,44.37 BRD1.P2.21 | v44.32,51.44 44.53,51.23 44.53,46.23 44.41,46.1 44.41,44.49 BRD1.P2.15
  Top 0.203: CHG_R2.2 18.31,47.12 v20.19,47.12
  Top 0.406: 5V_BOOST_CONVERTER.7 2.06,36.35 5V_BOOST_CONVERTER.P$7 | CONV_C1.2 4.87,40.13 3.36,38.62 5V_BOOST_CONVERTER.5 3.36,37.1 4.01,36.45 4.66,37.1 5V_BOOST_CONVERTER.3 | LED_R_1.1 4.42,51.03 v4.83,51.44 | CHARGE_CONTROLLER.9 17.52,42.92 CHARGE_CONTROLLER.6 v17.52,45.46 v17.53,45.47 | T2.P$1 5.08,49.02 v8.26,49.02 | U1.1 81.24,29.84 v76.83,29.84 | U1.10 96.04,17.78 v91.19,17.78
  Top 0.508: 5V_BOOST_CONVERTER.11 2.71,30.39 | 5V_BOOST_CONVERTER.4 4.01,38.8 | 5V_BOOST_CONVERTER.3 4.66,39.45
  Top 0.61: 2.71,30.39 2.03,29.72 v2.03,27.94 | CONV_C3.2 6.1,26.04 | 6.1,26.42 6.86,27.18 | 4.01,38.8 CONV_C1.2 | 4.66,39.45 CONV_C1.2 | CONV_C1.2 6.48,40.13 v7.11,40.77 | 4.01,36.45 4.01,35.25 5V_BOOST_CONVERTER.P$5 | RF_C1.2 78.99,12.83 77.72,14.1 77.72,14.48 | 77.72,14.48 77.72,15.11 78.42,15.81 U1.8 | 77.72,14.48 v76.2,14.48 | UFL_CON.2 88.98,13.41 88.01,12.45 88.01,11.94 | 88.01,11.94 88.01,11.43 88.98,10.46 UFL_CON.1 | 88.01,11.94 v86.23,11.94
  Top 1.016: 6.86,27.18 CONV_C2.2 7.37,29.84 v13.46,29.84 | 6.1,26.42 6.1,26.04 | PWR_C1.2 41.22,12.83 45.47,17.07 BRD1.P1.15 | 5V_BOOST_CONVERTER.4 4.01,36.45 | CHG_C2.2 v22.48,37.21 | CHARGE_CONTROLLER.9 17.4,42.8 v20.07,42.8 20.07,40.51 CHG_C1.2 | U2.2 83.95,45.21 85.72,45.21 86.48,44.45 9V_C2.2 v88.77,46.74 | ALT_9V.- v89.15,35.18 | 9V_C1.2 v101.22,35.18 | 83.34,44.93 80.58,44.93 74.55,38.9 ALT_PWR.- | RF_C1.2 79.63,11.94 v79.63,10.96 | v91.19,17.78 91.95,17.02 UFL_CON.2
  Bottom 0.406: J1.5 6.61,47.27
  Bottom 0.61: 6.61,47.27 7.6,48.26 8.51,48.26 | v7.11,40.77 6.74,41.14 2.21,41.14 1.33,42.02 1.33,49.84 2.92,51.44 v4.83,51.44
  Bottom 1.016: 9.78,48.9 9.78,48.48 11.61,46.65 11.61,44.4 BAT_R2.1 | v13.46,29.84 13.46,29.03 15.82,26.67 60.58,26.67 72.9,38.99 | BRD1.P1.15 45.47,11.56 45.21,11.3 | 45.21,11.3 22.23,11.3 20.32,9.4 SPI1.2.11 | 45.21,11.3 45.72,10.79 UART2.11 | 45.21,11.3 69.98,11.3 71.12,10.16 | I2C2.11 71.12,10.16 | SPI1.11 27.94,53.09 29.59,51.44 v44.32,51.44 44.32,52.2 45.47,53.34 52.7,53.34 | UART1.11 53.34,52.83 v54.99,51.18 76.45,51.18 78.74,53.47 I2C1.11 | v89.15,35.18 85.57,38.76 74.57,38.76 ALT_PWR.- | ALT_9V.- 94.49,32.77 94.49,32.64 99.69,32.64 101.22,34.16 v101.22,35.18 102.11,34.29 ANALOG.11 | DUAL_N_MOSFETS.1 17.53,46.55 v17.53,45.47 | 71.12,10.16 72.16,11.2 75.68,11.2 76.08,10.79 85.09,10.79 v86.23,11.94
  pour Bottom (isolate 0.406): -8.64,69.47 -8.64,-8.26 117.73,-8.26 117.73,69.47
I2C1_GPIO0  (via drill 0.35)
  Top 0.152: v64.23,57.85 64.23,57.72 63.34,56.83 63.34,46.01 63.31,45.97 BRD1.P2.30 | v67.34,59.31 67.69,59.31 I2C1.4
  Bottom 0.152: v67.34,59.31 67.01,59.64 65.39,59.64 64.23,58.48 v64.23,57.85
I2C1_GPIO1
  Top 0.152: I2C1.6 69.85,57.15 69.85,55.4 65.88,51.44 65.88,46.04 BRD1.P2.32
I2C1_GPIO2
  Top 0.152: I2C1.8 72.39,57.15 72.39,55.4 68.42,51.44 68.42,46.04 BRD1.P2.34
I2C1_GPIO3
  Top 0.152: I2C1.10 74.93,57.15 74.93,55.4 69.85,50.32 69.85,46.04 68.42,44.61 68.42,43.5 BRD1.P2.33
I2C1_SCL  (via drill 0.35)
  Top 0.152: v39.05,49.21 39.05,45.72 37.94,44.61 37.94,43.5 BRD1.P2.9 | v66.67,49.85 66.67,51.44 I2C1.5
  Bottom 0.152: v39.05,49.21 52.23,49.21 52.55,49.53 63.34,49.53 63.66,49.21 66.04,49.21 v66.67,49.85
I2C1_SDA  (via drill 0.35)
  Top 0.152: v40.8,49.85 39.37,48.42 39.37,45.56 40.32,44.61 40.32,43.5 BRD1.P2.11 | v63.98,49.85 63.98,50.13 68.58,54.74 I2C1.3
  Bottom 0.152: v63.98,49.85 v40.8,49.85
I2C2_GPIO0/AIN_3.3V_0  (via drill 0.35)
  Top 0.152: v73.5,16.35 73.5,12.86 77.47,8.89 77.47,7.14 78.26,6.35 80.01,6.35 80.96,5.4 | v102.55,39.37 102.55,30.05 97.34,24.84 91.26,24.84 90.4,23.98 90.4,22.89 84.94,17.42 84.91,17.42 81.93,14.45 81.93,8.72 82.55,8.1 82.55,6.99 80.96,5.4 | 80.96,5.4 I2C2.4
  Bottom 0.152: BRD1.P1.2 26.99,21.27 21.43,21.27 21.11,21.59 21.11,22.54 33.81,22.54 34.45,21.91 42.93,21.91 43.43,22.42 57.75,22.42 59.69,20.48 59.69,16.35 v73.5,16.35 | v102.55,39.37 ANALOG.7
I2C2_GPIO1/AIN_3.3V_1  (via drill 0.35)
  Top 0.152: v81.12,42.86 83.19,40.8 v83.19,40.48 | I2C2.6 79.53,5.08 80.8,3.81 84.3,3.81 85.46,4.97 85.48,4.97 88.32,7.8 v88.32,8 | v109.54,30.64 109.54,28.54 106.71,25.72 103.3,25.72 98.3,20.71 98.3,19.99 97.03,18.72 90.95,18.72 85.42,13.19 85.42,11.43 86.06,10.79 v86.06,8.1
  Bottom 0.152: BRD1.P2.35 71.44,42.86 v81.12,42.86 | v83.19,40.48 100.49,40.48 101.6,39.37 | 101.6,39.37 104.14,36.83 ANALOG.9 | v109.54,30.64 109.54,40.64 102.87,40.64 101.6,39.37 | v88.32,8 86.16,8 v86.06,8.1
I2C2_SCL
  Top 0.152: I2C2.5 78.74,8.1 75.41,11.43 75.41,17.46 71.28,21.59 62.87,21.59 61.91,20.64 60.8,20.64 BRD1.P1.28
I2C2_SDA  (via drill 0.35)
  Top 0.152: v64.14,12.7 59.21,17.62 59.21,18.41 58.26,19.37 58.26,20.48 BRD1.P1.26 | I2C2.3 81.15,7.62 v76.07,12.7
  Bottom 0.152: v76.07,12.7 v64.14,12.7
LED
  Top 0.406: PWR_STAT.K 6.93,53.87 LED_R_1.2
LED-
  Top 0.406: CHG_STAT.K 10.29,47.88 11.94,49.53 21.74,49.53 CHG_R1.2
LI-PO_5V_OUT  (via drill 1)
  Top 0.406: 4.01,31.06 4.01,30.35 4.01,29.39 CONV_C2.1
  Top 0.508: 5V_BOOST_CONVERTER.13 4.01,31.06 | 5V_BOOST_CONVERTER.15 5.31,31.15
  Top 0.61: CONV_C3.1 3.43,25.02 T6.P$1 1.91,22.23 2.67,21.46 | 5.31,31.15 5.31,30.58 CONV_C2.1
  Top 0.813: 5V_BOOST_CONVERTER.14 4.66,31.07
  Top 1.016: CONV_C2.1 4.06,26.8 CONV_C3.1 3.61,25.98 3.61,22.4 2.67,21.46 v1.78,20.57 4.56,23.36 4.56,23.57 5.37,24.38 11.43,24.38 ALT_SWITCH.2 15.21,24.77 v16.15,23.82 | 4.66,31.07 4.66,31 4.01,30.35 | v81.53,51.56 75.56,45.59 75.56,44.24 70.82,39.5 28.32,39.5 26.42,37.59 v26.42,24.77
  Bottom 0.61: 1.78,15.62 BAT_PWR.1
  Bottom 1.016: v1.78,20.57 1.78,15.62 | 9V_CON.1 96.37,49.94 96.37,50.05 94.85,51.56 v81.53,51.56 | v16.15,23.82 25.48,23.82 v26.42,24.77
LI-PO_+  (via drill 0.6)
  Top 0.406: 5V_BOOST_CONVERTER.9 5V_BOOST_CONVERTER.8 | T4.P$1 20.5,27.33 20.5,31.7 LIPO.+ | CHARGE_CONTROLLER.3 17.52,37.34
  Top 0.508: 5V_BOOST_CONVERTER.6 2.71,39.96 | 5V_BOOST_CONVERTER.8 1.41,39 | 17.52,37.34 CHG_C2.1
  Top 0.559: 5V_BOOST_CONVERTER.9 1.41,30.72
  Top 0.61: 2.71,39.96 CONV_C1.1 1.41,39 | 1.41,30.72 v1.52,30.61
  Top 1.016: CHG_C2.1 17.78,36.83 LIPO.+
  Bottom 1.016: v1.52,30.61 8.51,30.61 CONV_L1.P$1 12.17,34.27 BAT_R1.1 17.63,34.27 LIPO.+
LI-PO_-
  Top 0.406: T5.P$1 16,27.56 LIPO.-
  Bottom 0.152: BATTERY_PROTECTION.4 15.39,41.76 15.49,41.79
  Bottom 0.406: 15.49,41.79 BAT_C1.2 17.91,41.78 14.1,45.59 DUAL_N_MOSFETS.3
  Bottom 1.016: BAT_C1.2 19.07,39.37 20.52,37.92 20.52,32.11 17.83,29.41 LIPO.-
N$1
  Top 0.406: 97.28,13.21 97.28,12.57 T8.P$1 95.5,11.3 94.18,12.62
  Top 1.016: UFL_CON.3 94.18,12.62 94.77,13.21 97.28,13.21 ANT_CON.1
N$20  (via drill 0.6)
  Top 0.406: 5V_BOOST_CONVERTER.2 6.25,38.73 | 5V_BOOST_CONVERTER.1 6.9,38.73 v7.62,38.73
  Top 0.61: 6.25,38.73 v7.62,38.73
  Bottom 0.406: 10.08,38.73 CONV_L1.P$2
  Bottom 0.61: v7.62,38.73 10.08,38.73
N$21  (via drill 0.35)
  Top 0.152: v33.5,61.44 SPI1.14 | v98.74,53.98 97.31,53.98 95.89,55.4 95.89,56.36 95.09,57.15 93.34,57.15 SPI1_BRK.2
  Bottom 0.152: v33.5,61.44 34.45,62.39 100.49,62.39 103.82,59.05 103.82,53.98 v98.74,53.98
N$23  (via drill 0.35)
  Top 0.152: SPI1.13 31.27,55.88 32.54,57.15 36.2,57.15 v40.01,60.96 | SPI1_BRK.1 v87.15,60.8
  Bottom 0.152: v40.01,60.96 40.16,60.8 v87.15,60.8
N$24  (via drill 0.35)
  Top 0.152: SPI1.15 35.88,55.88 42.07,62.07 57.78,62.07 v58.42,61.44 | v86.04,61.44 86.04,59.37 SPI1_BRK.3
  Bottom 0.152: v86.04,61.44 v58.42,61.44
N$25  (via drill 0.35)
  Top 0.152: v37.59,54.74 40.01,57.15 53.82,57.15 54.61,56.36 54.61,54.74 55.37,53.98 v59.82,53.98 | v62.83,57.82 62.83,54.1 v62.71,53.98 | v68.45,60.13 78.77,60.13 80.01,58.9 80.01,55.4 81.12,54.29 90.49,54.29 SPI1_BRK.4
  Bottom 0.152: v37.59,54.74 33.91,58.42 SPI1.16 | v62.71,53.98 v59.82,53.98 | v68.45,60.13 65.15,60.13 v62.83,57.82
N$26  (via drill 0.35)
  Top 0.152: SPI1.2.13 17.11,7.62 15.84,6.35 14.76,6.35 v13.65,5.24
  Bottom 0.152: v13.65,5.24 13.65,1.12 98.91,1.12 SPI1.2_BRK.1
N$27
  Bottom 0.152: SPI1.2.14 19.37,3.49 98.74,3.49 SPI1.2_BRK.2
N$28  (via drill 0.35)
  Top 0.152: SPI1.2.16 15.68,5.08 v17.63,3.13 | v38.73,4.92 38.1,5.56 35.79,5.56 33.82,3.59 v33.82,2.88
  Bottom 0.152: v33.82,2.88 33.57,3.13 v17.63,3.13 | v38.73,4.92 40.16,6.35 99.06,6.35 SPI1.2_BRK.4
N$29
  Bottom 0.152: SPI1.2.15 16.51,6.35 16.51,1.44 98.43,1.44 101.6,4.6 101.6,7.62 SPI1.2_BRK.3
N$30  (via drill 0.35)
  Top 0.152: v93.19,60.33 93.19,59.85 UART1_BRK.1
  Bottom 0.152: UART1.13 57.15,57.15 76.68,57.15 77.47,57.94 77.47,60.17 93.03,60.17 v93.19,60.33
N$31
  Bottom 0.152: UART1.15 59.69,54.61 76.68,54.61 77.47,55.4 77.47,57.15 93.34,57.15 UART1_BRK.3
N$32  (via drill 0.35)
  Top 0.152: v55.88,61.44 UART1.14
  Bottom 0.152: v55.88,61.44 56.52,62.07 100.33,62.07 103.5,58.9 103.5,57.15 98.42,57.15 UART1_BRK.2
N$33
  Top 0.152: UART1.16 59.69,58.42 63.66,62.39 100.01,62.39 103.5,58.9 103.5,55.4 102.71,54.61 98.42,54.61 UART1_BRK.4
N$35  (via drill 0.35)
  Top 0.152: UART2.15 41.43,7.62 42.7,8.89 51.28,8.89 52.07,8.1 52.07,4.6 53.18,3.49 59.2,3.49 65.87,10.16 v75.25,10.16
  Bottom 0.152: v75.25,10.16 75.56,9.84 95.57,9.84 UART2_BRK.3
N$36
  Top 0.152: UART2.16 41.43,5.08 45.09,1.42 90.8,1.42 93.98,4.6 93.98,6.35 UART2_BRK.4
N$37  (via drill 0.35)
  Top 0.152: v50.3,2.88 49.7,3.49 45.55,3.49 43.97,5.08 UART2.14 | v93.19,2.86 95.25,4.92 UART2_BRK.2
  Bottom 0.152: v93.19,2.86 92.88,3.16 50.58,3.16 v50.3,2.88
N$38
  Top 0.152: UART2.13 42.39,7.62 41.12,6.35 40.16,6.35 39.37,5.56 39.37,4.6 42.86,1.11 93.82,1.11 UART2_BRK.1
N$39
  Top 0.152: I2C1.16 85.25,58.42 89.06,54.61 90.01,54.61 90.81,55.4 90.81,58.9 92.87,60.96 96.36,60.96 98.42,58.9 98.42,57.94 99.22,57.15 100.97,57.15 I2C1_BRK.4
N$40
  Bottom 0.152: I2C1.15 85.72,53.98 97.79,53.98 I2C1_BRK.3
N$41
  Top 0.152: I2C1.13 81.28,56.67 82.55,57.94 82.55,58.9 85.72,62.07 96.04,62.07 I2C1_BRK.1
N$42
  Bottom 0.152: I2C1.14 82.55,59.69 100.97,59.69 I2C1_BRK.2
N$43  (via drill 0.35)
  Top 0.152: I2C2.15 66.36,7.62 68.26,9.53 v74.45,9.53
  Bottom 0.152: v74.45,9.53 90.81,9.53 I2C2_BRK.3
N$44  (via drill 0.35)
  Top 0.152: I2C2.16 66.04,5.87 67.31,7.14 67.31,8.1 68.1,8.89 v75.25,8.89
  Bottom 0.152: v75.25,8.89 88.9,8.89 I2C2_BRK.4
N$45
  Top 0.152: I2C2.14 69.37,5.08 70.96,3.49 84.47,3.49 86.79,5.82 89.43,5.82 I2C2_BRK.2
N$46
  Top 0.152: I2C2.13 68.58,6.83 67.31,5.56 67.31,4.6 68.75,3.16 84.67,3.16 86.97,5.46 88.14,5.46 89.69,3.91 90.65,3.91 90.68,3.94 91.57,3.94 I2C2_BRK.1
N$47
  Top 0.152: ANALOG.15 105.41,30 104.14,31.27 104.14,50.96 105.25,52.07 ANALOG_BRK.3
N$48
  Top 0.152: ANALOG.16 107.95,30 109.54,31.59 109.54,50.48 107.95,52.07 ANALOG_BRK.4
N$49
  Top 0.152: ANALOG.14 107.95,32.54 109.22,33.81 109.22,48.9 106.52,51.59 106.52,53.34 107.79,54.61 ANALOG_BRK.2
N$50  (via drill 0.35)
  Top 0.152: v103.5,32.07 103.5,52.86 105.25,54.61 ANALOG_BRK.1
  Bottom 0.152: ANALOG.13 105.09,32.07 v103.5,32.07
PROG
  Top 0.203: CHARGE_CONTROLLER.8 16.52,45.2 15.34,46.38 CHG_R2.1
RF_ANT
  Top 0.61: 99.51,15.81 ANT_CON.2
  Top 1.016: U1.9 99.51,15.81
RF_CLK  (via drill 0.35)
  Top 0.152: v73.18,23.97 81.09,23.97 U1.4 | v39.05,24.29 35.4,20.64 BRD1.P1.8
  Bottom 0.152: v73.18,23.97 72.87,24.29 v39.05,24.29
RF_CS  (via drill 0.35)
  Top 0.152: v74.45,21.91 81.01,21.91 U1.5 | v34.77,22.54 32.86,20.64 BRD1.P1.6
  Bottom 0.152: v74.45,21.91 73.18,23.18 56.99,23.18 56.61,22.8 35.02,22.8 v34.77,22.54
RF_DIO0  (via drill 0.35)
  Top 0.152: U1.14 96.78,25.81 97.57,26.6 97.57,32.6 v93.98,36.2 | v84.77,39.85 81.76,42.86 v81.76,43.66
  Bottom 0.152: v93.98,36.2 90.33,39.85 v84.77,39.85 | v81.76,43.66 78.74,46.67 71.6,46.67 71.28,46.99 55.24,46.99 54.13,45.88 54.13,44.45 49.05,44.45 48.1,43.5 BRD1.P2.17
RF_DIO1  (via drill 0.35)
  Top 0.152: v54.04,36.79 59.41,36.79 70.17,26.04 70.17,24.77 77.95,16.99 82.56,16.99 93.36,27.78 96.07,27.78 U1.15
  Bottom 0.152: v54.04,36.79 53.76,36.51 32.86,36.51 26.67,42.7 26.67,44.93 46.99,44.93 47.94,45.88 BRD1.P2.18
RF_DIO2  (via drill 0.35)
  Top 0.152: v92.08,30 96.07,30 U1.16 | v80.64,37.62 80.64,40.01 v79.06,41.59
  Bottom 0.152: v92.08,30 84.45,37.62 v80.64,37.62 | v79.06,41.59 63.66,41.59 62.71,42.55 61.28,42.55 61.12,42.39 52.7,42.39 51.75,43.34 50.64,43.34 BRD1.P2.19
RF_DIO3  (via drill 0.35)
  Top 0.152: v93.03,20 96.07,20 U1.11 | v67.94,30.64 66.04,30.64 58.9,37.78 v54.13,37.78 | v41.91,42.7 v43.34,41.27
  Bottom 0.152: v93.03,20 82.39,30.64 v67.94,30.64 | v54.13,37.78 53.63,37.78 52.74,36.89 47.72,36.89 v43.34,41.27 | v41.91,42.7 41.91,44.61 48.74,44.61 50.01,45.88 50.48,45.88 BRD1.P2.20
RF_DIO4  (via drill 0.35)
  Top 0.152: v107.03,26.99 106.27,26.23 103.38,26.23 99.06,21.91 96.39,21.91 U1.12 | v71.91,47.31 v73.18,48.58
  Bottom 0.152: v107.03,26.99 107.35,27.3 108.74,27.3 110.81,29.37 110.81,45.72 103.5,45.72 103.19,45.4 87.47,45.4 84.3,48.58 v73.18,48.58 | v71.91,47.31 54.45,47.31 53.18,46.04 BRD1.P2.22
RF_DIO5  (via drill 0.35)
  Top 0.152: v76.36,43.5 72.55,39.69 72.55,22.86 77.47,17.94 81.07,17.94 U1.7
  Bottom 0.152: v76.36,43.5 74.93,44.93 57.15,44.93 56.2,45.88 55.72,45.88 BRD1.P2.24
RF_MISO  (via drill 0.35)
  Top 0.152: v76.04,27.78 81.23,27.78 U1.2 | v42.23,24.92 37.94,20.64 BRD1.P1.10
  Bottom 0.152: v76.04,27.78 73.5,25.24 60.33,25.24 60.01,25.56 46.35,25.56 45.72,24.92 v42.23,24.92
RF_MOSI  (via drill 0.35)
  Top 0.152: v73.18,25.88 80.76,25.88 U1.3 | BRD1.P1.12 40.39,21.68 43.62,24.92 v43.62,25.56
  Bottom 0.152: v73.18,25.88 43.94,25.88 v43.62,25.56
RF_RST  (via drill 0.35)
  Top 0.152: v71.82,36.26 70.04,38.04 66.86,38.04 66.86,37.78 v63.59,34.51 | v37.47,27.78 30.32,20.64 BRD1.P1.4 | U1.6 82.68,21.21 82.68,30.4 81.33,31.75 74.3,31.75 73.03,33.02 73.03,35.81 v73.47,36.26
  Bottom 0.152: v73.47,36.26 v71.82,36.26 | v63.59,34.51 56.86,27.78 v37.47,27.78
SPI1.2_CS  (via drill 0.35)
  Top 0.152: v36.35,40.96 36.35,43.5 37.78,44.93 37.78,45.88 BRD1.P2.10 | v36.67,38.42 36.67,33.5 v26.35,23.18 | SPI1.2.9 22.86,9.53 v19.18,13.21
  Bottom 0.152: v36.35,40.96 36.35,38.42 v36.67,38.42 | v26.35,23.18 26.04,22.86 20.13,22.86 19.18,21.91 v19.18,13.21
SPI1.2_GPIO0  (via drill 0.35)
  Top 0.152: v43.5,10.16 49.05,15.72 49.05,17.94 50.48,19.37 50.48,20.48 BRD1.P1.20
  Bottom 0.152: v43.5,10.16 42.23,8.89 36.04,8.89 33.5,6.35 31.75,6.35 SPI1.2.4
SPI1.2_GPIO1  (via drill 0.35)
  Top 0.152: v58.74,41.43 58.9,41.59 60.33,41.59 61.75,43.02 61.75,43.97 60.8,44.93 60.8,45.88 BRD1.P2.28 | v47.47,34.13 33.81,20.48 v33.81,17.14 | v29.05,12.38 29.05,8.26 29.21,8.1 29.21,6.35 SPI1.2.6
  Bottom 0.152: v58.74,41.43 58.9,41.59 60.01,41.59 60.33,41.27 60.33,34.13 v47.47,34.13 | v29.05,12.38 v33.81,17.14
SPI1_CLK  (via drill 0.35)
  Top 0.152: v59.69,40.96 62.39,40.96 63.18,41.75 63.18,43.34 BRD1.P2.29 | v28.42,49.53 28.42,50.32 SPI1.7 | v25.4,13.34 SPI1.2.7 | v33.34,27.94 v25.4,20
  Bottom 0.152: 32.75,36.14 26.35,42.55 26.35,49.53 v28.42,49.53 | 32.75,36.14 33.34,35.56 v33.34,27.94 | v25.4,20 v25.4,13.34 | v59.69,40.96 59.5,40.77 58.17,40.77 57.28,41.66 54.99,41.66 54.74,41.4 54.74,38.04 54.74,38.03 54.74,36.48 54.4,36.14 32.75,36.14
SPI1_CS  (via drill 0.35)
  Top 0.152: v64.29,48.58 64.29,46.04 65.72,44.61 65.72,43.5 BRD1.P2.31 | v32.07,48.26 32.07,49.21 SPI1.9
  Bottom 0.152: v64.29,48.58 63.98,48.26 v32.07,48.26
SPI1_GPIO0
  Top 0.152: SPI1.4 17.78,58.1 19.05,56.83 19.05,55.4 19.84,54.61 21.59,54.61 27.62,48.58 27.62,46.04 BRD1.P2.2
SPI1_GPIO1
  Top 0.152: SPI1.6 21.59,57.15 21.59,55.4 28.73,48.26 28.73,46.04 30.16,44.61 30.16,43.5 BRD1.P2.3
SPI1_GPIO2
  Top 0.152: SPI1.8 24.13,57.15 24.13,55.4 30.16,49.37 30.16,46.04 BRD1.P2.4
SPI1_GPIO3
  Top 0.152: SPI1.10 26.67,57.15 26.67,55.4 32.7,49.37 32.7,46.04 BRD1.P2.6
SPI1_GPIO4
  Top 0.152: SPI1.12 29.21,57.15 29.21,55.4 35.24,49.37 35.24,46.04 BRD1.P2.8
SPI1_MISO  (via drill 0.35)
  Top 0.152: 19.84,59.69 19.05,58.9 19.05,57.31 20.32,56.04 SPI1.5 | 19.84,59.69 22.54,62.39 58.42,62.39 59.05,61.75 59.05,61.12 57.15,59.21 57.15,57.94 57.94,57.15 59.69,57.15 61.28,55.56 61.28,50.01 59.69,48.42 59.69,45.56 60.64,44.61 60.64,43.5 BRD1.P2.27 | v15.24,13.37 16.51,12.1 v16.51,9.3 | v14.22,26.32 14.76,26.86 14.76,34.13 5.24,43.66 2.86,43.66 1.11,45.4 1.11,54.77 3.33,56.99 7.62,56.99 10.32,59.69 19.84,59.69
  Bottom 0.152: SPI1.2.5 26.67,6.35 26.67,3.81 19.84,3.81 18.95,4.71 18.95,5.56 18.26,6.25 17.21,6.25 16.51,6.95 v16.51,9.3 | v14.22,26.32 14.22,24.54 14.99,23.78 14.99,23.15 15.24,22.89 v15.24,13.37
SPI1_MOSI  (via drill 0.35)
  Top 0.152: v54.93,44.93 54.93,45.24 54.13,46.04 v54.13,48.9 | SPI1.3 18.03,55.88 22.16,51.75 v23.05,51.75 23.56,51.75 v25.15,50.16 | SPI1.2.3 30.48,11.91 v29.05,13.34 | v20.48,21.75 20.48,22.54 23.34,25.4 23.34,44.61 v23.18,44.77
  Bottom 0.152: BRD1.P2.25 56.67,44.93 v54.93,44.93 | v54.13,48.9 53.82,48.58 32.7,48.58 31.11,50.16 v25.15,50.16 | v29.05,13.34 29.05,19.53 26.83,19.53 25.4,20.95 21.27,20.95 v20.48,21.75 | v23.05,51.75 23.05,44.9 v23.18,44.77
STAT
  Top 0.203: CHG_R1.1 21.69,46.2 20.83,45.34 18.54,45.34 18.02,44.82 CHARGE_CONTROLLER.5
SWITCH_5V
  Top 0.61: 18.29,14.48 20.32,16.51 T7.P$1 22.35,16.51 24.38,14.48 | PWR_STAT.A 12.42,50.93 22.82,50.93 24.09,49.66 24.09,22.95 18.92,17.78 18.92,16 17.4,14.48
  Top 1.016: BRD1.P1.7 35.31,14.78 PWR_C1.1 37.28,12.85 35.66,14.48 24.38,14.48 18.29,14.48 17.4,14.48 16.76,14.48 | BAT_PWR.2 16.76,14.48 | 16.76,14.48 16.76,17.27 ALT_SWITCH.3
UART1_GPIO0  (via drill 0.35)
  Top 0.152: v56.52,23.65 59.21,20.95 59.21,20.16 59.53,19.84 59.53,17.78 60.33,16.99 66.2,16.99 67.15,17.94 68.26,17.94 BRD1.P1.33 | v27.62,23.18 25.72,21.27 25.08,21.27 24.77,21.59 24.77,38.89 28.26,42.39 30.64,42.39 31.75,43.5 31.75,43.81 32.86,44.93 35.72,44.93 36.83,46.04 36.83,56.36 40.16,59.69 41.91,59.69 UART1.4
  Bottom 0.152: v56.52,23.65 56.04,23.18 v27.62,23.18
UART1_GPIO1  (via drill 0.35)
  Top 0.152: v67.31,22.54 66.67,22.54 53.34,35.88 v53.34,38.42 | v49.69,41.75 48.26,41.75 46.99,43.02 46.99,52.94 v45.52,54.41
  Bottom 0.152: v67.31,22.54 67.79,22.07 69.37,22.07 69.37,20.16 68.74,19.53 67.31,19.53 65.88,18.1 BRD1.P1.31 | v53.34,38.42 53.34,41.75 v49.69,41.75 | v45.52,54.41 44.45,55.48 44.45,57.15 UART1.6
UART1_GPIO2  (via drill 0.35)
  Top 0.152: v56.83,24.92 59.53,22.23 59.53,20.32 60.33,19.53 60.64,19.53 62.07,18.1 63.18,18.1 BRD1.P1.29 | v59.69,24.92 59.69,29.05 52.39,36.35 v52.39,38.42 | v52.39,41.12 52.39,42.7 51.82,43.27 51.82,50.96 v54.48,53.63 | v54.74,57.12 54.69,57.17 54.69,59.58 54.58,59.69 49.53,59.69 UART1.8
  Bottom 0.152: v59.69,24.92 v56.83,24.92 | v52.39,41.12 v52.39,38.42 | v54.74,57.12 54.59,56.97 54.59,53.73 v54.48,53.63
UART1_GPIO3  (via drill 0.35)
  Top 0.152: v62.55,22.54 60.8,24.29 59.37,24.29 56.52,27.15 56.52,31.27 51.44,36.35 v51.44,38.42 | v51.44,41.12 51.44,42.86 51.5,42.93 v51.5,54.45
  Bottom 0.152: BRD1.P1.34 66.36,22.54 v62.55,22.54 | v51.44,41.12 v51.44,38.42 | v51.5,54.45 52.07,55.02 52.07,57.15 UART1.10
UART1_GPIO4  (via drill 0.35)
  Top 0.152: v69.85,22.54 69.85,25.88 66.36,29.37 63.59,29.37 v60.42,32.54 | v62.1,41.56 61.82,41.85 61.82,42.65 62.06,42.9 62.06,44.1 61.82,44.34 v61.82,57.91
  Bottom 0.152: v69.85,22.54 69.85,20.16 70.48,19.53 70.8,19.53 70.8,18.1 BRD1.P1.35 | v61.82,57.91 61.88,57.98 61.75,58.1 60.48,58.1 58.97,59.61 54.53,59.61 UART1.12 | v60.42,32.54 62.1,34.23 v62.1,41.56
UART1_RX  (via drill 0.35)
  Top 0.152: v61.59,22.54 60.64,22.54 56.2,26.99 56.2,31.11 50.48,36.83 v50.48,38.42 | v50.48,41.12 50.48,42.07 49.05,43.5 49.05,52.55 UART1.5
  Bottom 0.152: BRD1.P1.32 64.45,21.91 62.23,21.91 v61.59,22.54 | v50.48,41.12 v50.48,38.42
UART1_TX  (via drill 0.35)
  Top 0.152: v60.8,21.91 55.88,26.83 55.88,30.96 49.53,37.31 v49.53,38.42 | v46.67,41.27 46.67,52.39 UART1.3
  Bottom 0.152: BRD1.P1.30 62.23,21.59 61.12,21.59 v60.8,21.91 | v46.67,41.27 v49.53,38.42
UART2_GPIO0/PWM0  (via drill 0.35)
  Top 0.152: UART2.4 57.15,3.81 58.9,3.81 69.37,14.29 69.37,17.94 70.8,19.37 70.8,20.48 BRD1.P1.36 | v96.36,42.23 96.36,40.32 92.87,36.83 84.93,36.83 83.5,35.4 v83.5,28.57
  Bottom 0.152: ANALOG.3 103.19,42.23 v96.36,42.23 | v83.5,28.57 75.56,20.64 70.96,20.64 BRD1.P1.36
UART2_GPIO1/PWM1  (via drill 0.35)
  Top 0.152: UART2.6 53.34,5.87 54.61,7.14 54.61,8.1 53.82,8.89 v52.39,8.89 | v52.39,10.16 52.39,17.3 51.59,18.1 51.59,30.16 v50.8,30.96
  Bottom 0.152: BRD1.P2.1 29.21,41.91 48.9,41.91 49.37,42.39 52.23,42.39 52.55,42.07 60.64,42.07 | 60.64,42.07 61.59,42.07 61.75,42.23 62.55,42.23 63.82,40.96 82.71,40.96 83.34,41.59 105.09,41.59 ANALOG.5 | v52.39,10.16 v52.39,8.89 | v50.8,30.96 53.66,33.81 60.48,33.81 60.64,33.97 60.64,42.07
UART2_RX  (via drill 0.35)
  Top 0.152: v32.86,41.27 32.86,43.34 BRD1.P2.5 | v45.56,37.15 54.13,28.57 v54.13,10.16
  Bottom 0.152: v32.86,41.27 36.53,37.6 45.1,37.6 v45.56,37.15 | v54.13,10.16 54.13,7.62 UART2.5
UART2_TX  (via drill 0.35)
  Top 0.152: v38.58,40.96 v36.99,42.55 | v45.56,38.1 54.61,29.05 54.61,13.18 59.69,8.1 59.69,7.14 58.9,6.35 57.15,6.35 UART2.3
  Bottom 0.152: BRD1.P2.7 36.2,42.55 v36.99,42.55 | v38.58,40.96 41.43,38.1 v45.56,38.1
V-
  Bottom 0.254: BATTERY_PROTECTION.6 14.23,41.66 BAT_R2.2
V_USB  (via drill 1)
  Top 0.406: v8.51,43.81 7.49,43.81 6.48,44.83 T3.P$1 | CHARGE_CONTROLLER.1 16.52,40.14 CHG_C1.1
  Top 1.016: CHG_C1.1 15.62,39.88 11.69,43.81 v8.51,43.81
  Bottom 0.406: J1.1 7.37,44.67 | 7.37,44.67 7.65,44.67 | CHG_STAT.A 7.75,45.05 7.37,44.67
  Bottom 1.016: 7.65,44.67 v8.51,43.81
VCC  (via drill 0.6)
  Top 0.61: SPI1.1 18.16,52.96 v19.05,52.96 | v29.08,35.31 30.23,34.16 v35.56,34.16 | v46.74,31.37 v44.45,29.08 47.37,26.16 47.37,24.13 43.81,20.57 BRD1.P1.14 41.66,19.3 v41.66,16.26 | v56.26,40.89 55.63,41.53 BRD1.P2.23 56.9,44.7 56.9,51.69 | SPI1.2.1 37.85,7.62 v43.05,12.83 44.58,12.83 v46.99,15.24 | v47.12,12.57 50.42,12.57 v51.44,13.59 | v57.78,13.34 60.45,10.67 v60.45,8.46 | I2C2.1 83.82,12.32 RF_C1.1 83.31,13.59 93.53,23.81 U1.13 96.01,23.75 v91.69,23.75 | UART1.1 43.31,53.21 v43.31,52.96 43.98,52.96 45.16,51.78 45.16,51.74 v45.85,51.05 | 56.9,51.69 56.13,52.45 54.28,52.45 52.96,51.13 v52.96,51.05 | 56.9,51.69 58.17,52.96 v60.33,52.96 | v64.64,53.34 66.04,54.74 | 66.04,54.74 I2C1.1 | v70.87,49.78 74.68,53.59 v74.68,53.72 | v66.54,53.73 66.04,54.23 66.04,54.74 | T1.P$1 22.33,26.52 v22.33,32.08 | v70.21,31.77 69.03,32.95 v69.03,36.76 | v63.6,37.72 60.1,37.72 v59.59,38.23
  Bottom 0.61: v19.05,52.96 21.84,50.16 21.84,40.64 27.18,35.31 v29.08,35.31 25.86,32.08 v22.33,32.08 | v35.56,34.16 38.04,31.69 | 38.04,31.69 40.64,29.08 v44.45,29.08 | v41.66,16.26 41.66,14.22 v43.05,12.83 | v46.99,15.24 47.12,15.11 v47.12,12.57 | v51.44,13.59 57.53,13.59 v57.78,13.34 | v60.45,8.46 59.61,7.62 UART2.1 | v52.96,51.05 v45.85,51.05 | v60.33,52.96 64.26,52.96 v64.64,53.34 | ANALOG.1 103.12,46.99 102.36,46.23 91.31,46.23 87.76,49.78 v70.87,49.78 | v74.68,53.72 v66.55,53.72 v66.54,53.73 | 38.04,31.69 38.04,31.05 v35.43,28.45 | v46.74,31.37 46.74,33.68 46.63,33.78 46.63,34.48 47.56,35.41 54.89,35.41 57.6,38.12 57.49,38.23 | 57.49,38.23 56.26,39.46 v56.26,40.89 | v91.69,23.75 83.67,31.77 v70.21,31.77 | v69.03,36.76 64.56,36.76 v63.6,37.72 | v59.59,38.23 57.49,38.23
VCC_5V  (via drill 0.6)
  Top 0.61: v15.49,60.96 v19.56,60.96 | v42.8,60.07 v48.88,60.07 | I2C1.2 64.9,58.42 v63.35,59.97 | v38.99,54.48 41.66,51.82 41.66,44.7 BRD1.P2.13 42.93,42.93 v45.09,40.77 | v38.86,57.15 40.13,58.42 UART1.2 | BRD1.P1.24 55.14,21.06 55.14,29.27 48.64,35.77 48.64,37.21 v47.88,37.97 | v56.1,16.53 56.1,12.94 v59.05,9.98 | v62.36,8.69 58.75,5.08 UART2.2 | v37.06,4.24 38.68,2.62 v39.73,2.62 | v45.54,2.62 49.39,2.62 49.96,2.05 59.76,2.05 | v62.46,4.75 59.76,2.05 | 59.76,2.05 86.05,2.05 v86.21,2.21 86.21,3.25 v87.27,4.32 | v110.59,46.79 110.59,27.81 v109.86,27.08 | v102.23,20.6 102.23,12.62 98.93,9.32 87.53,9.32 87.27,9.07 87.27,7.52 85.26,5.5 85.24,5.5 84.81,5.08 I2C2.2
  Bottom 0.61: SPI1.2 15.24,60.71 v15.49,60.96 | v19.56,60.96 32,60.96 33.02,59.94 39.12,59.94 UART1.2 42.29,60.07 v42.8,60.07 | v63.35,59.97 63.07,60.25 49.05,60.25 v48.88,60.07 | v38.99,54.48 38.99,57.02 v38.86,57.15 | v47.88,37.97 v45.09,40.77 | BRD1.P1.24 56.84,19.36 56.84,16.76 56.61,16.53 v56.1,16.53 | v59.05,9.98 61.06,9.98 v62.36,8.69 | SPI1.2.2 36.22,5.08 v37.06,4.24 | v39.73,2.62 v45.54,2.62 | v62.46,4.75 58.75,4.75 UART2.2 | v87.27,4.32 84.58,4.32 I2C2.2 | ANALOG.2 110.39,46.99 v110.59,46.79 | v109.86,27.08 108.84,26.06 104.8,26.06 102.23,23.5 v102.23,20.6

### Text on the board
tPlace: GPIO | GPIO | GPIO | 5V | 5V | 5V | 3V | 3V | 3V | MOSI | MISO | CLK | CS | GND | TX | GND | SDA | SCL | GND | RX | BRK | BRK | BRK | 3V | 5V | VREF+ | RICE ECLIPSE / RTR TX Ver. 1 | PWM | AIN 1.8V | AIN 3.3V | GND | BRK | VREF- | CS | CLK | MISO | MOSI | GND | GND | RX | TX | GND | SCL | SDA | 3V | 3V | 3V | 5V | 5V | 5V | GPIO | GPIO | GPIO | BRK | BRK | BRK
bPlace: + | 9V_PWR | _